# EAGLE schematic IO Buffer (EAGLE 9.6.2)
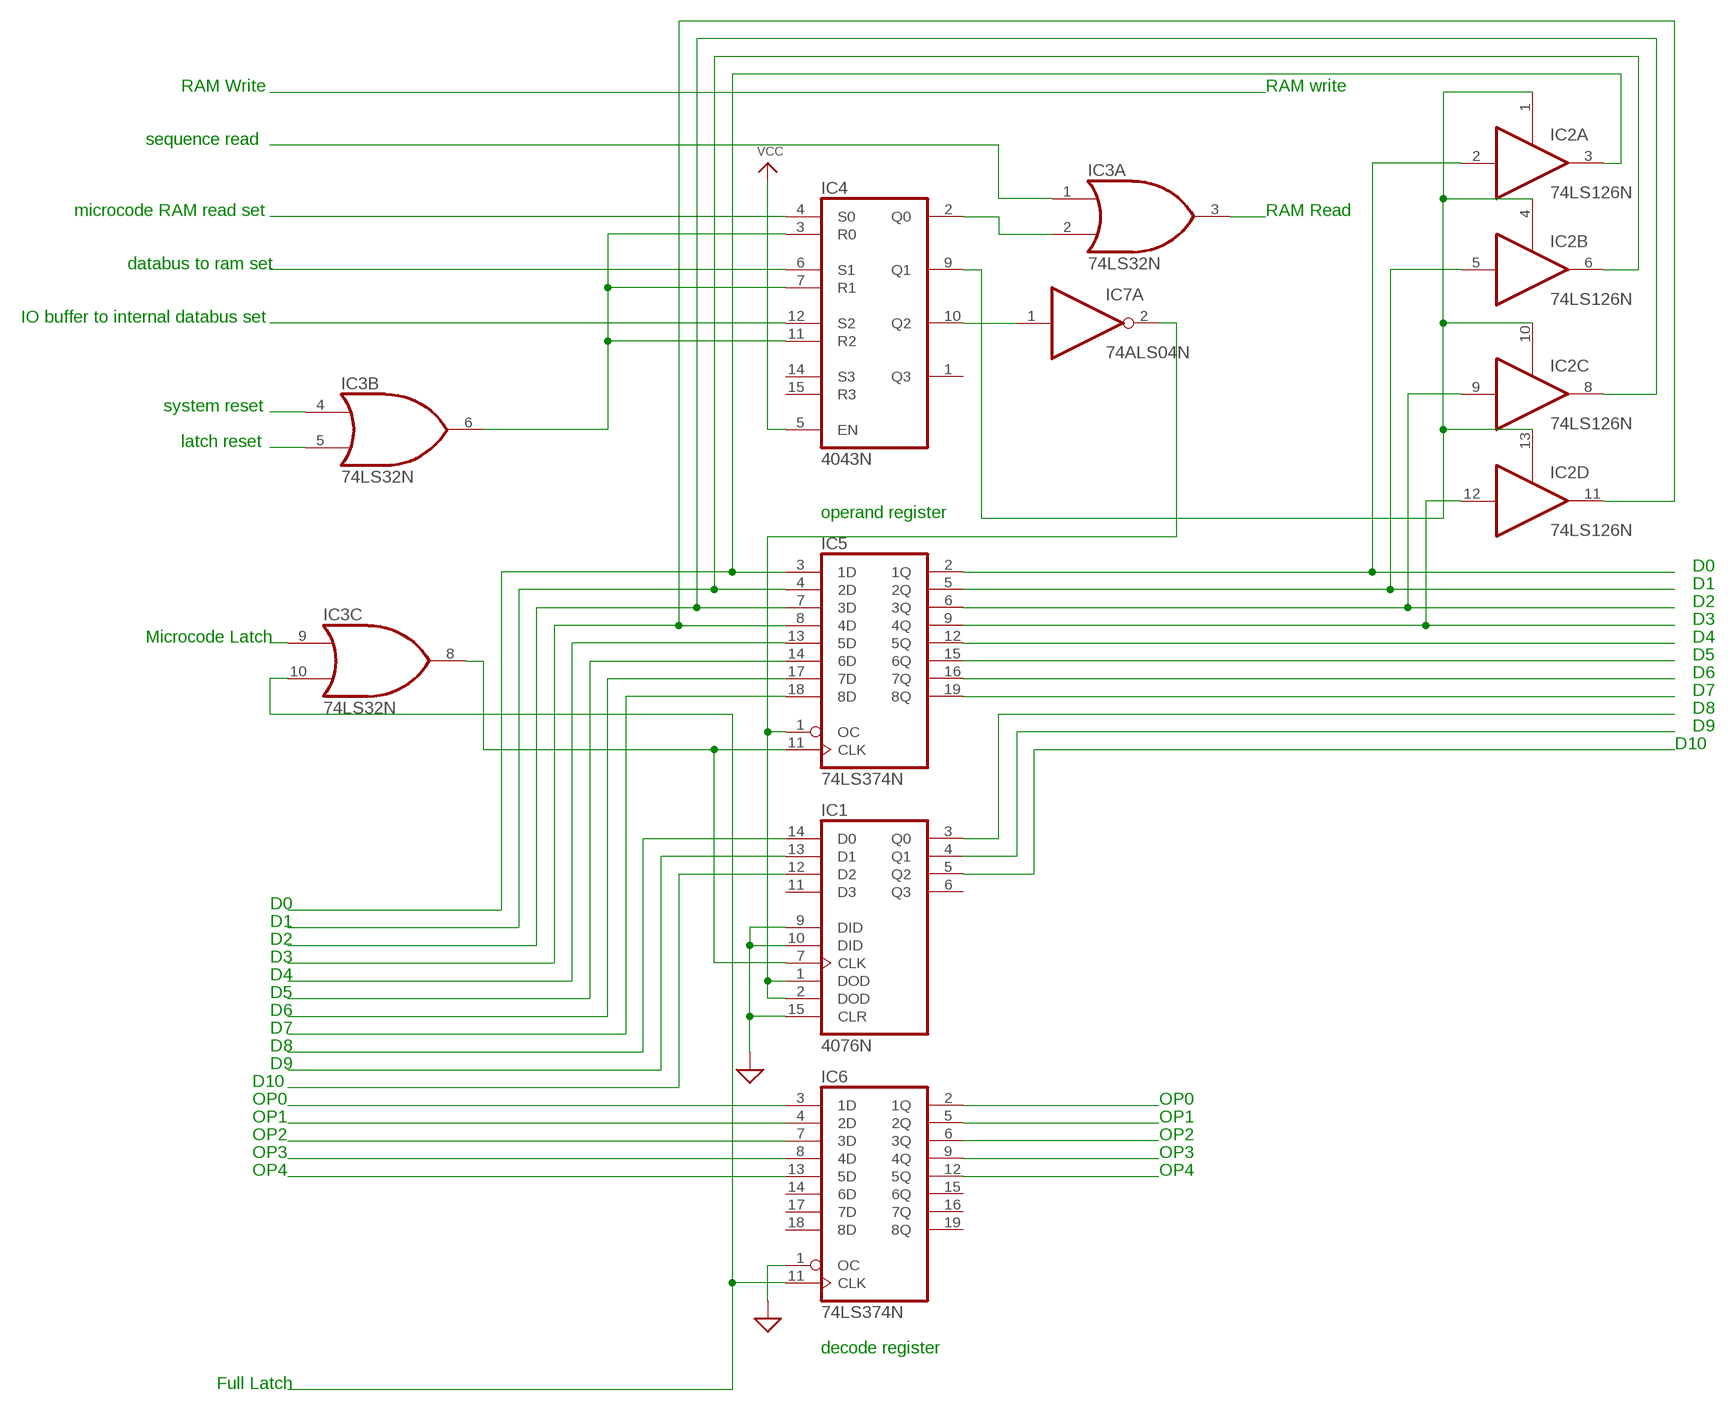
[diagram p0: schematic, sheet 1]

## Parts
IC1  4076N  [DIL16]
IC2  74LS126N  [DIL14]
IC3  74LS32N  [DIL14]
IC4  4043N  [DIL16]
IC5  74LS374N  [DIL20]
IC6  74LS374N  [DIL20]
IC7  74ALS04N  [DIL14]

## Nets
GND: IC1.9(DID) IC1.10(DID) IC1.15(CLR) IC6.1(OC) ; supply symbol labelled SUP
N$1: IC2.3(A:O) IC5.3(1D)
N$2: IC6.12(5Q)
N$3: IC6.3(1D)
N$4: IC2.11(D:O) IC5.8(4D)
N$5: IC5.13(5D)
N$6: IC5.14(6D)
N$7: IC5.17(7D)
N$8: IC5.18(8D)
N$9: IC1.14(D0)
N$10: IC1.13(D1)
N$11: IC1.12(D2)
N$12: IC1.4(Q1)
N$13: IC6.4(2D)
N$14: IC6.7(3D)
N$15: IC6.8(4D)
N$16: IC6.13(5D)
N$17: IC3.10(C:I1) IC6.11(CLK)
N$18: IC1.7(CLK) IC3.8(C:O) IC5.11(CLK)
N$19: IC3.1(A:I0)
N$20: IC3.9(C:I0)
N$21: IC2.2(A:I) IC5.2(1Q)
N$22: IC5.12(5Q)
N$23: IC2.5(B:I) IC5.5(2Q)
N$24: IC2.9(C:I) IC5.6(3Q)
N$25: IC1.1(DOD) IC1.2(DOD) IC5.1(OC) IC7.2(A:O)
N$26: IC2.6(B:O) IC5.4(2D)
N$27: IC1.5(Q2)
N$32: IC3.6(B:O) IC4.3(R0) IC4.7(R1) IC4.11(R2)
N$33: IC4.4(S0)
N$34: IC3.4(B:I0)
N$35: IC3.5(B:I1)
N$36: IC3.2(A:I1) IC4.2(Q0)
N$37: IC3.3(A:O)
N$40: IC2.1(A:OE) IC2.4(B:OE) IC2.10(C:OE) IC2.13(D:OE) IC4.9(Q1)
N$41: IC4.6(S1)
N$45: IC4.12(S2)
N$46: IC4.10(Q2) IC7.1(A:I)
N$47: IC2.8(C:O) IC5.7(3D)
N$49: IC2.12(D:I) IC5.9(4Q)
N$50: IC5.15(6Q)
N$51: IC5.16(7Q)
N$52: IC5.19(8Q)
N$53: IC1.3(Q0)
N$57: IC6.2(1Q)
N$58: IC6.5(2Q)
N$59: IC6.6(3Q)
N$60: IC6.9(4Q)
VCC: IC4.5(EN)
Unconnected: IC1.6(Q3) IC1.11(D3) IC3.11(D:O) IC3.12(D:I0) IC3.13(D:I1) IC4.1(Q3) IC4.14(S3) IC4.15(R3) IC6.14(6D) IC6.15(6Q) IC6.16(7Q) IC6.17(7D) IC6.18(8D) IC6.19(8Q) IC7.3(B:I) IC7.4(B:O) IC7.5(C:I) IC7.6(C:O) IC7.8(D:O) IC7.9(D:I) IC7.10(E:O) IC7.11(E:I) IC7.12(F:O) IC7.13(F:I)

## Notes on the sheet
- RAM Write | RAM write
- sequence read
- microcode RAM read set | RAM Read
- databus to ram set
- IO buffer to internal databus set
- system reset
- latch reset
- operand register
- D0
- D1
- D2
- D3
- Microcode Latch | D4
- D5
- D6
- D7
- D8
- D9
- D10
- D0
- D1
- D2
- D3
- D4
- D5
- D6
- D7
- D8
- D9
- D10
- OP0 | OP0
- OP1 | OP1
- OP2 | OP2
- OP3 | OP3
- OP4 | OP4
- decode register
- Full Latch

## Power pins joined to a net without a drawn wire
GND: IC2.7(P:GND) IC3.7(P:GND) IC5.10(GND) IC6.10(GND) IC7.7(P:GND)
VCC: IC2.14(P:VCC) IC3.14(P:VCC) IC5.20(VCC) IC6.20(VCC) IC7.14(P:VCC)
VDD: IC1.16(VDD) IC4.16(VDD)
VSS: IC1.8(VSS) IC4.8(VSS)

## Library data of the parts
IC1 = 40xx:4076: Quad D-type REGISTER
IC2 = 74xx-us:74*126: Quad bus BUFFER, 3-state
IC3 = 74xx-us:74*32: Quad 2-input OR gate
IC4 = 40xx:4043: Quad 3-state NOR R/S LATCH
IC5 IC6 = 74xx-us:74*374: Octal D type transparent LATCH, edge triggered
IC7 = 74xx-us:74*04: Hex INVERTER